# EAGLE design ATmegaBootloader (EAGLE 7.3.0)
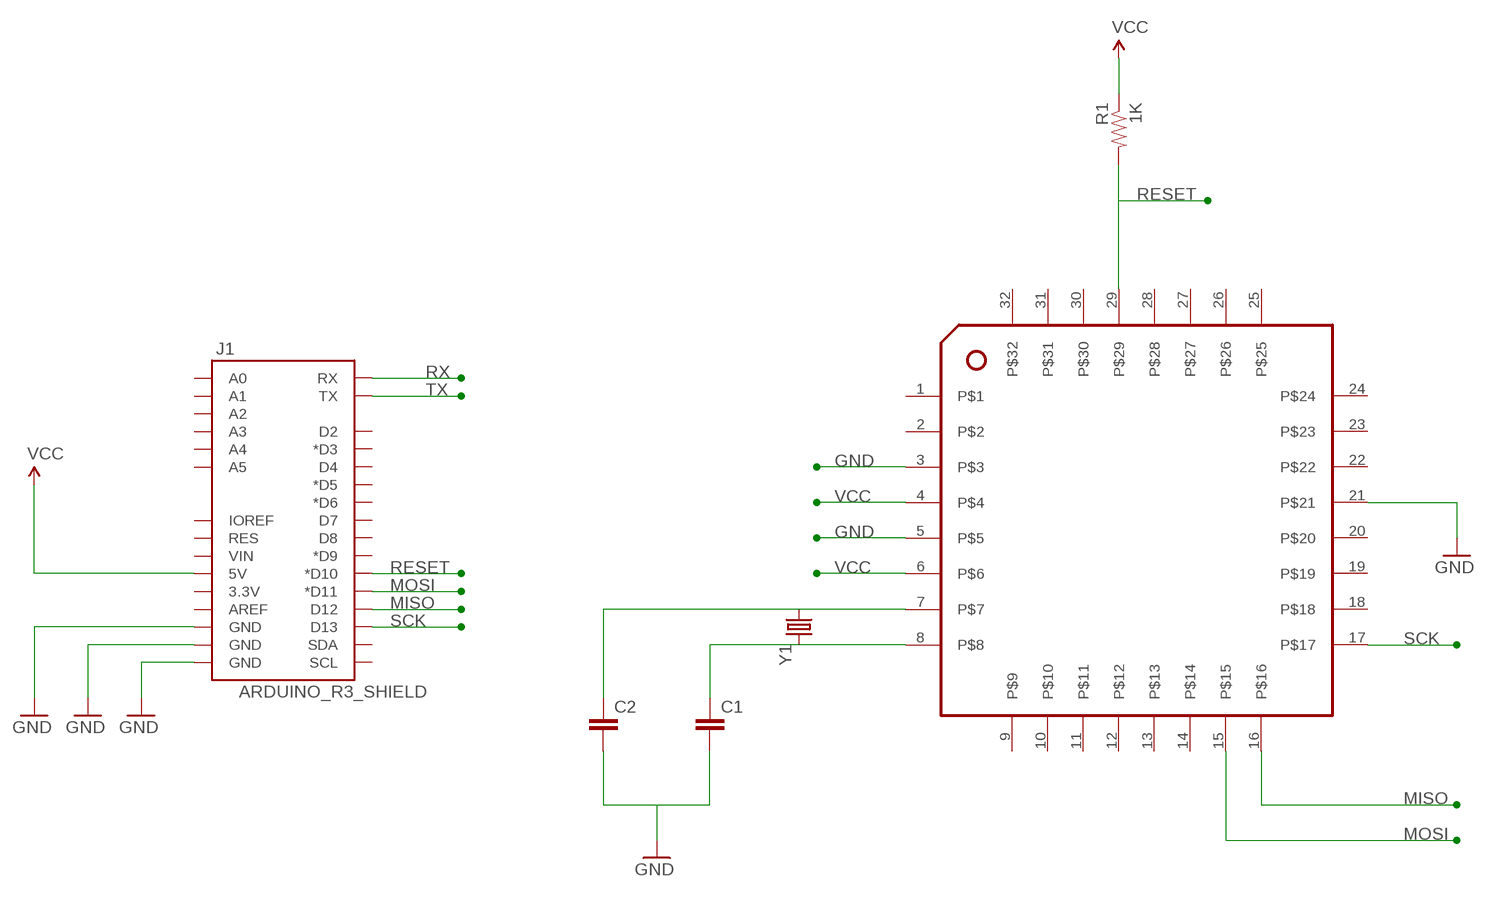
[diagram p0: schematic, sheet 1]

## Parts
C1  0.1UF-50V-20%(PTH)KIT-EZ  [CAP-PTH-SMALL-KIT]
C2  0.1UF-50V-20%(PTH)KIT-EZ  [CAP-PTH-SMALL-KIT]
J1  ARDUINO_R3_SHIELD  [UNO_R3_SHIELD]
R1  1K  1KOHM-1/4W-1%(PTH)  [AXIAL-0.3]
U$1  ATMEGA-TQFP-BREAKOUT  [TQFP32-BREAKOUT]
Y1  CRYSTALHC49US  [HC49US]

## Nets
GND: C1.2 C2.2 J1.GND@0(GND) J1.GND@1(GND) J1.GND@2(GND) U$1.3 U$1.5 U$1.21
MISO: J1.D12 U$1.16
MOSI: J1.D11(*D11) U$1.15
N$1: C2.1 U$1.7 Y1.1
N$2: C1.1 U$1.8 Y1.2
RESET: J1.D10(*D10) R1.P$2 U$1.29
RX: J1.RX
SCK: J1.D13 U$1.17
TX: J1.TX
VCC: J1.5V R1.P$1 U$1.4 U$1.6
Unconnected: J1.3.3V J1.A0 J1.A1 J1.A2 J1.A3 J1.A4 J1.A5 J1.AREF J1.D2 J1.D3(*D3) J1.D4 J1.D5(*D5) J1.D6(*D6) J1.D7 J1.D8 J1.D9(*D9) J1.IOREF J1.RES J1.SCL J1.SDA J1.VIN U$1.1 U$1.2 U$1.9 U$1.10 U$1.11 U$1.12 U$1.13 U$1.14 U$1.18 U$1.19 U$1.20 U$1.22 U$1.23 U$1.24 U$1.25 U$1.26 U$1.27 U$1.28 U$1.30 U$1.31 U$1.32

## Library data of the parts
C1 C2 = SparkFun-Capacitors:0.1UF-50V-20%(PTH): CAP-08370; PROD_ID: CAP-08370
J1 = SparkFun-Boards:ARDUINO_R3_SHIELD: Shield form compatible with the Arduino Uno R3.
R1 = SparkFun-Resistors:1KOHM-1/4W-1%(PTH): RES-12182; PROD_ID: RES-12182
U$1 = MakerWear:ATMEGA-TQFP-BREAKOUT
Y1 = SparkFun-FreqCtrl:CRYSTAL: Various standard crystals. Proven footprints.

## Board
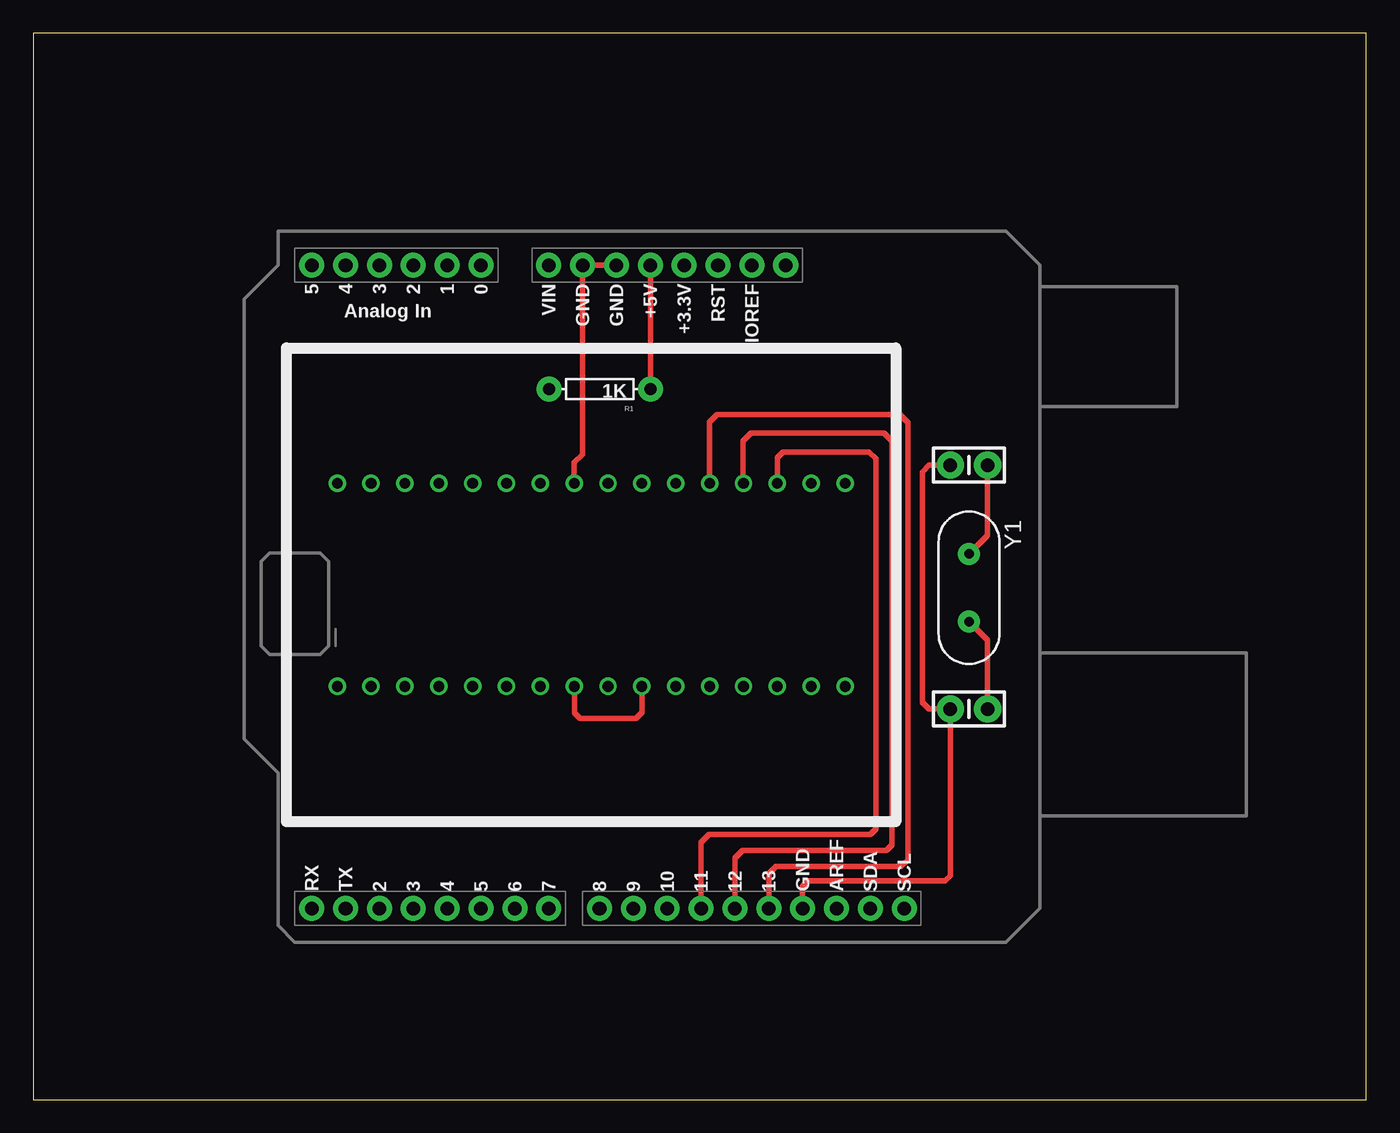
[diagram p1: board, top side]
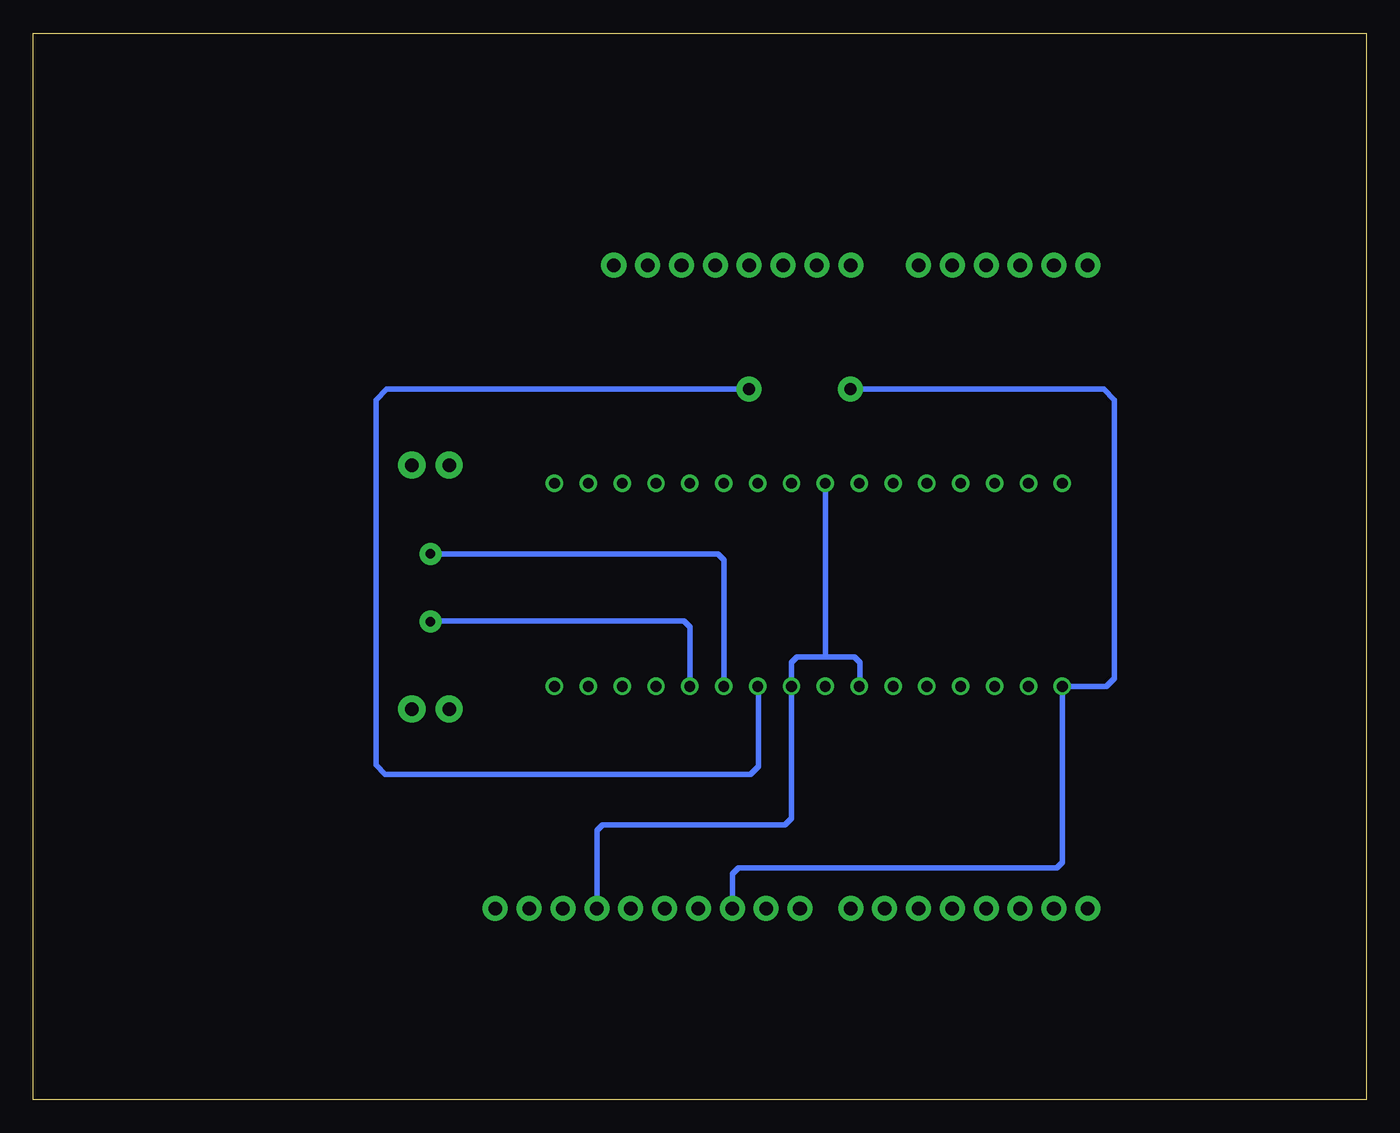
[diagram p2: board, bottom side, seen from below]

Size 100 x 80 mm. Coordinates in mm from the lower left corner, seen from the top.
Outline: 0,0 100,0 100,80 0,80 0,0
Copper layers (1*16): Top 0.035mm / dielectric 1.5mm / Bottom 0.035mm
Design rules "default *": minimum track width 10mil, minimum drill 24mil, track to track 8mil, track to pad 8mil, pad to pad 8mil, via to via 8mil, smd to smd 8mil, copper to edge 0mil, drill to drill 8mil, minimum pad ring 10mil, minimum via ring 8mil, stop-mask expansion 4mil, vias tented up to drill 0mil, thermal gap 0mil

### Footprints (pad centres in the part's own frame; a part is rotated, then mirrored left to right if it is on the bottom)
CAP-PTH-SMALL-KIT = drill 1.016 pad 2.032: 1 -1.397,0; 2 1.397,0
UNO_R3_SHIELD = drill 1.016 pad 1.88: 3.3V 50.8,26.67; 5V 50.8,29.21; A0 50.8,41.91; A1 50.8,44.45; A2 50.8,46.99; A3 50.8,49.53; A4 50.8,52.07; A5 50.8,54.61; AREF 2.54,15.24; D2 2.54,49.53; D3 2.54,46.99; D4 2.54,44.45; D5 2.54,41.91; D6 2.54,39.37; D7 2.54,36.83; D8 2.54,33.02; D9 2.54,30.48; D10 2.54,27.94; D11 2.54,25.4; D12 2.54,22.86; D13 2.54,20.32; GND@0 50.8,31.75; GND@1 50.8,34.29; GND@2 2.54,17.78; IOREF 50.8,21.59; NC 50.8,19.05; RES 50.8,24.13; RX 2.54,54.61; SCL 2.54,10.16; SDA 2.54,12.7; TX 2.54,52.07; VIN 50.8,36.83
AXIAL-0.3 = drill 0.9 pad 1.88: P$1 -3.81,0; P$2 3.81,0
TQFP32-BREAKOUT = drill 0.8: 1 0,27.94; 2 0,25.4; 3 0,22.86; 4 0,20.32; 5 0,17.78; 6 0,15.24; 7 0,12.7; 8 0,10.16; 9 0,7.62; 10 0,5.08; 11 0,2.54; 12 0,0; 13 15.24,0; 14 15.24,2.54; 15 15.24,5.08; 16 15.24,7.62; 17 15.24,10.16; 18 15.24,12.7; 19 15.24,15.24; 20 15.24,17.78; 21 15.24,20.32; 22 15.24,22.86; 23 15.24,25.4; 24 15.24,27.94; 25 15.24,30.48; 26 15.24,33.02; 27 15.24,35.56; 28 15.24,38.1; 29 0,38.1; 30 0,35.56; 31 0,33.02; 32 0,30.48
HC49US = drill 0.7 pad 1.651: 1 -2.54,0; 2 2.54,0

### Placement (x,y rotation side)
C1  70.2,29.3 180 top
C2  70.2,47.6 180 top
J1  75.5,11.8 90 top
R1  42.5,53.3 180 top
U$1  60.9,31 90 top
Y1  70.2,38.4 270 top

### Tracks (layer width: path | path; a pad name or v marks a point on that pad's centre or on a via)
GND
  Top 0.406: C1.2 | C2.2 67.2,47.6 66.7,47.1 66.7,29.8 67.2,29.3 C1.2 | J1.GND@0 J1.GND@1 41.21,48.41 40.58,47.78 U$1.21 | C1.2 68.8,16.8 68.4,16.4 58.1,16.4 57.7,16 57.7,14.36 J1.GND@2
  Bottom 0.406: C1.2 | 40.7,33.2 42.7,33.2 43.12,32.78 U$1.5 43.12,21.08 43.6,20.6 57.3,20.6 57.7,20.2 57.7,14.36 J1.GND@2 | 40.7,33.2 40.5,33.2 | 40.5,33.2 38.4,33.2 38,32.8 38,31.04 U$1.3 | 40.6,33.3 40.5,33.2 | U$1.21 40.58,33.32 40.7,33.2
MISO
  Top 0.406: J1.D12 52.64,18.14 53.2,18.7 64,18.7 64.4,19.1 64.4,49.4 63.8,50 53.85,50 53.26,49.41 53.26,46.26 U$1.16
MOSI
  Top 0.406: J1.D11 50.1,19.3 50.7,19.9 62.8,19.9 63.2,20.3 63.2,48.1 62.7,48.6 56.26,48.6 55.82,48.16 U$1.15
N$1
  Top 0.406: C2.1 71.6,42.34 Y1.1
  Bottom 0.406: Y1.1 48.64,40.94 48.2,40.5 U$1.7
N$2
  Top 0.406: C1.1 71.6,34.46 Y1.2
  Bottom 0.406: U$1.8 50.74,35.44 51.2,35.9 70.16,35.9 Y1.2
RESET
  Bottom 0.406: J1.D10 47.56,16.94 47.1,17.4 23.2,17.4 22.8,17.8 U$1.29 19.5,31 18.9,31.6 18.9,52.5 19.7,53.3 R1.P$2
SCK
  Top 0.406: J1.D13 55.18,16.98 55.7,17.5 65.1,17.5 65.6,18 65.6,50.8 65,51.4 51.29,51.4 50.72,50.83 50.72,46.26 U$1.17
VCC
  Top 0.406: R1.P$1 46.31,62.58 J1.5V | U$1.6 45.66,29.06 45.2,28.6 41,28.6 40.6,29 40.6,30.98 U$1.4
  Bottom 0.406: R1.P$1 73.5,53.3 74.3,52.5 74.3,25.1 73.6,24.4 46.2,24.4 45.6,25 45.6,30.94 U$1.6